# EAGLE design CPSBoard (EAGLE 6.1)
AUTHOR: Benjamin Babjak; AUTHOREMAIL: benjamin.babjak@vanderbilt.edu; PAGE1: Cover page; PAGE2: Connector; PAGE3: Analog Signals; PAGE4: Control/Digital Signals; PAGE5: Supply; REVIEWER1: Peter Volgyesi; REVIEWER2: Sandor Szilvasi; REVIEWEREMAIL1: peter.volgyesi@vanderbilt.edu; REVIEWEREMAIL2: sandor.szilvasi@vanderbilt.edu; REVISION: A; TITLE: Radio Front-End Board

## Sheet 1 of 5
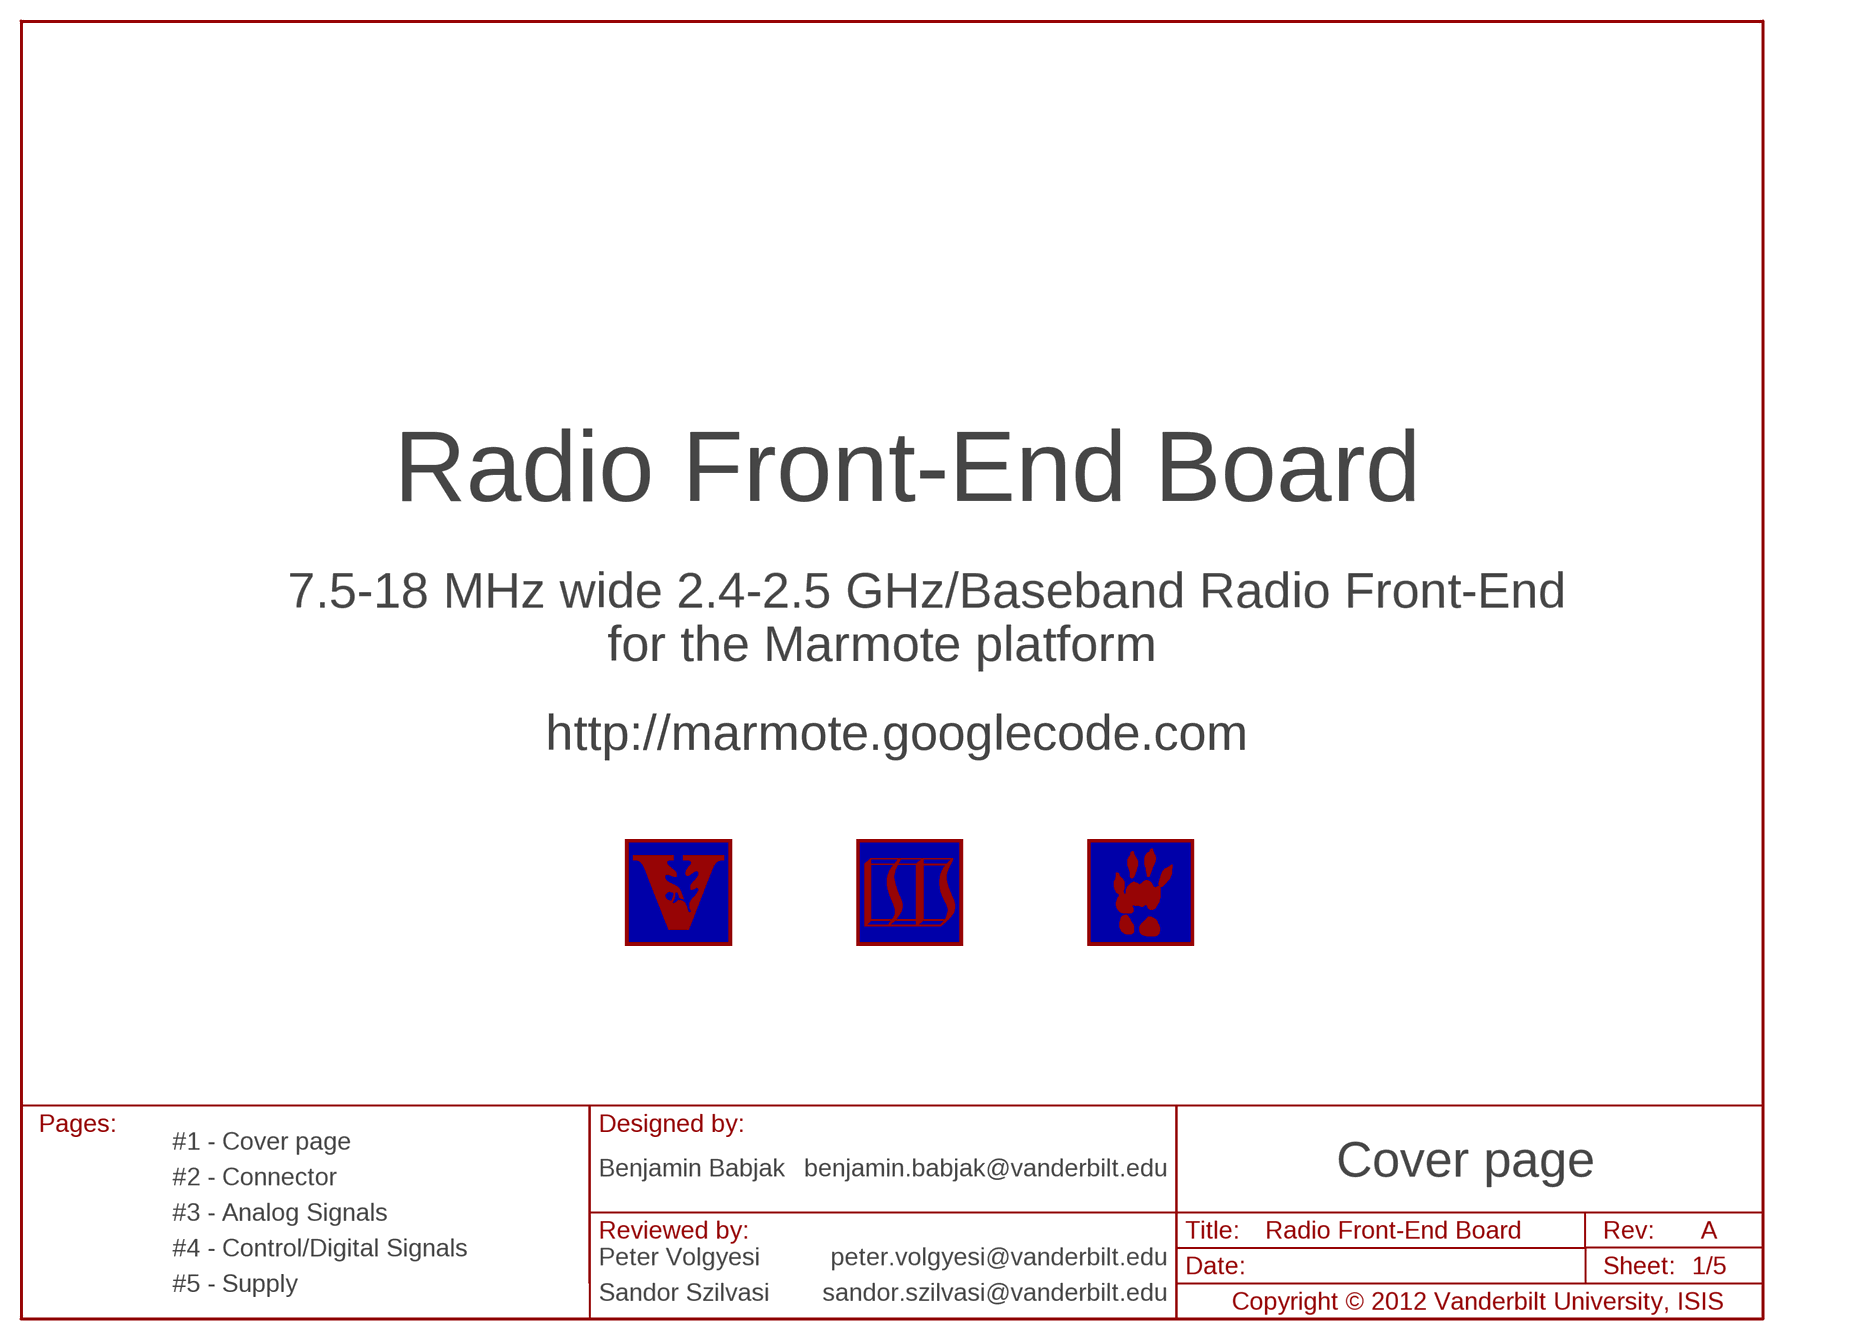
[diagram p0: schematic, sheet 1]

### Parts
LOGO1  LOGO-ISIS-600MIL-10MM-AU  [LOGO-ISIS-10MM-GOLD]
LOGO2  LOGO-MARMOTE-600MIL-10MM-AU  [LOGO-MARMOTE-10MM-GOLD]
LOGO3  LOGO-VANDERBILT-600MIL-10MM-AU  [LOGO-VANDERBILT-10MM-GOLD]

### Notes on the sheet
- 7.5-18 MHz wide 2.4-2.5 GHz/Baseband Radio Front-End
- for the Marmote platform
- http://marmote.googlecode.com

## Sheet 2 of 5
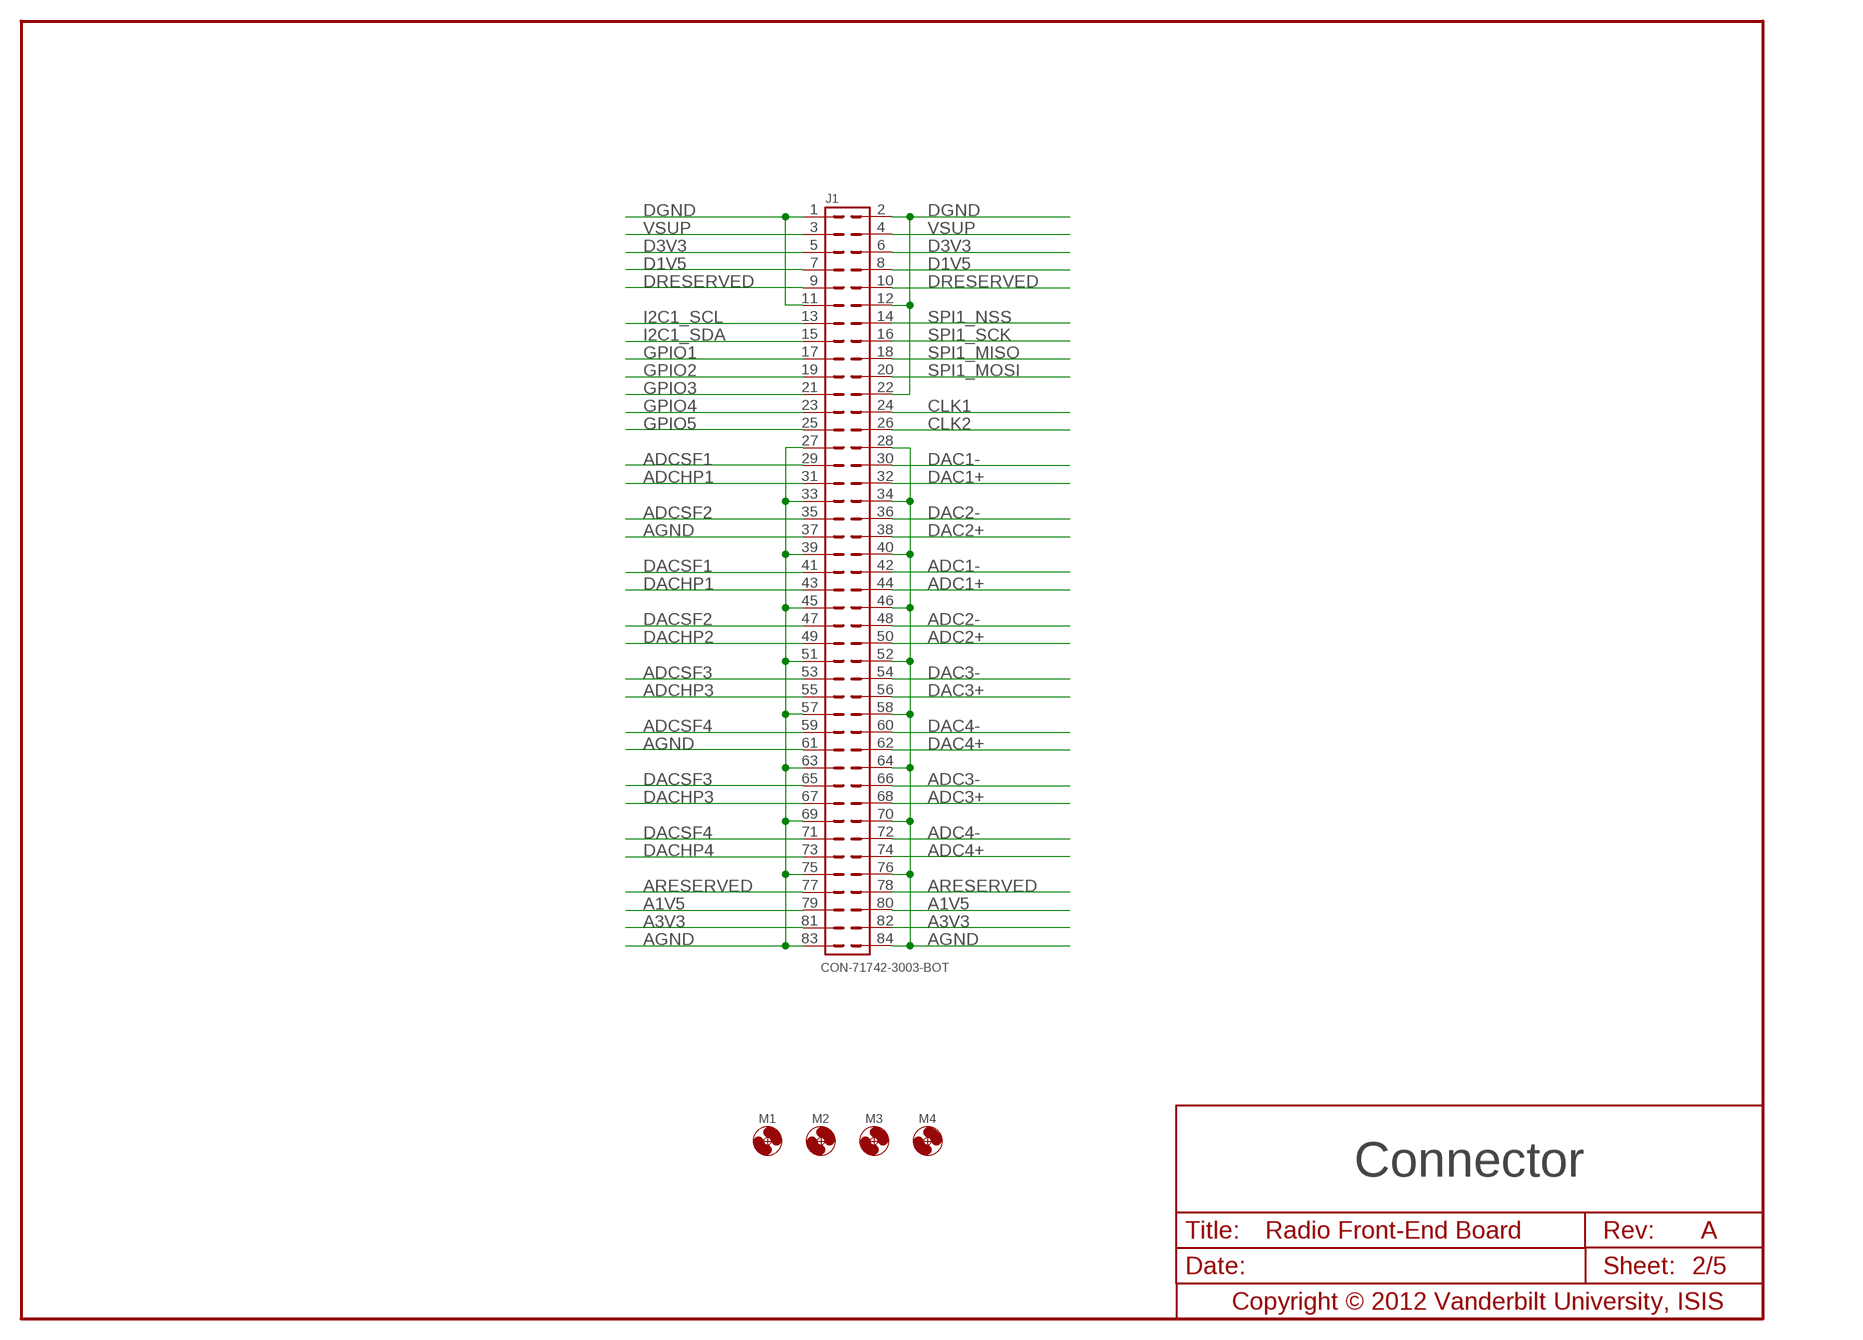
[diagram p1: schematic, sheet 2]

### Parts
J1  CON-71742-3003-BOT  [71742-3003-BOT]
M1  MOUNT-HOLE3.3  [3,3]
M2  MOUNT-HOLE3.3  [3,3]
M3  MOUNT-HOLE3.3  [3,3]
M4  MOUNT-HOLE3.3  [3,3]

### Nets
A1V5: J1.79 J1.80
A3V3: J1.81 J1.82 ; also sheet 5
ADC1+: J1.44
ADC1-: J1.42
ADC2+: J1.50
ADC2-: J1.48
ADC3+: J1.68
ADC3-: J1.66
ADC4+: J1.74
ADC4-: J1.72
ADCHP1: J1.31
ADCHP3: J1.55
ADCSF1: J1.29
ADCSF2: J1.35
ADCSF3: J1.53
ADCSF4: J1.59
AGND: J1.27 J1.28 J1.33 J1.34 J1.37 J1.39 J1.40 J1.45 J1.46 J1.51 J1.52 J1.57 J1.58 J1.61 J1.63 J1.64 J1.69 J1.70 J1.75 J1.76 J1.83 J1.84 ; also sheet 3,5
ARESERVED: J1.77 J1.78
CLK1: J1.24
CLK2: J1.26
D1V5: J1.7 J1.8
D3V3: J1.5 J1.6 ; also sheet 4
DAC1+: J1.32
DAC1-: J1.30
DAC2+: J1.38
DAC2-: J1.36
DAC3+: J1.56
DAC3-: J1.54
DAC4+: J1.62
DAC4-: J1.60
DACHP1: J1.43
DACHP2: J1.49
DACHP3: J1.67
DACHP4: J1.73
DACSF1: J1.41
DACSF2: J1.47
DACSF3: J1.65
DACSF4: J1.71
DGND: J1.1 J1.2 J1.11 J1.12 J1.22 ; also sheet 4
DRESERVED: J1.9 J1.10
GPIO1: J1.17 ; also sheet 4
GPIO2: J1.19 ; also sheet 4
GPIO3: J1.21 ; also sheet 4
GPIO4: J1.23 ; also sheet 4
GPIO5: J1.25 ; also sheet 4
I2C1_SCL: J1.13 ; also sheet 4
I2C1_SDA: J1.15 ; also sheet 4
SPI1_MISO: J1.18 ; also sheet 4
SPI1_MOSI: J1.20 ; also sheet 4
SPI1_NSS: J1.14 ; also sheet 4
SPI1_SCK: J1.16 ; also sheet 4
VSUP: J1.3 J1.4

## Sheet 3 of 5
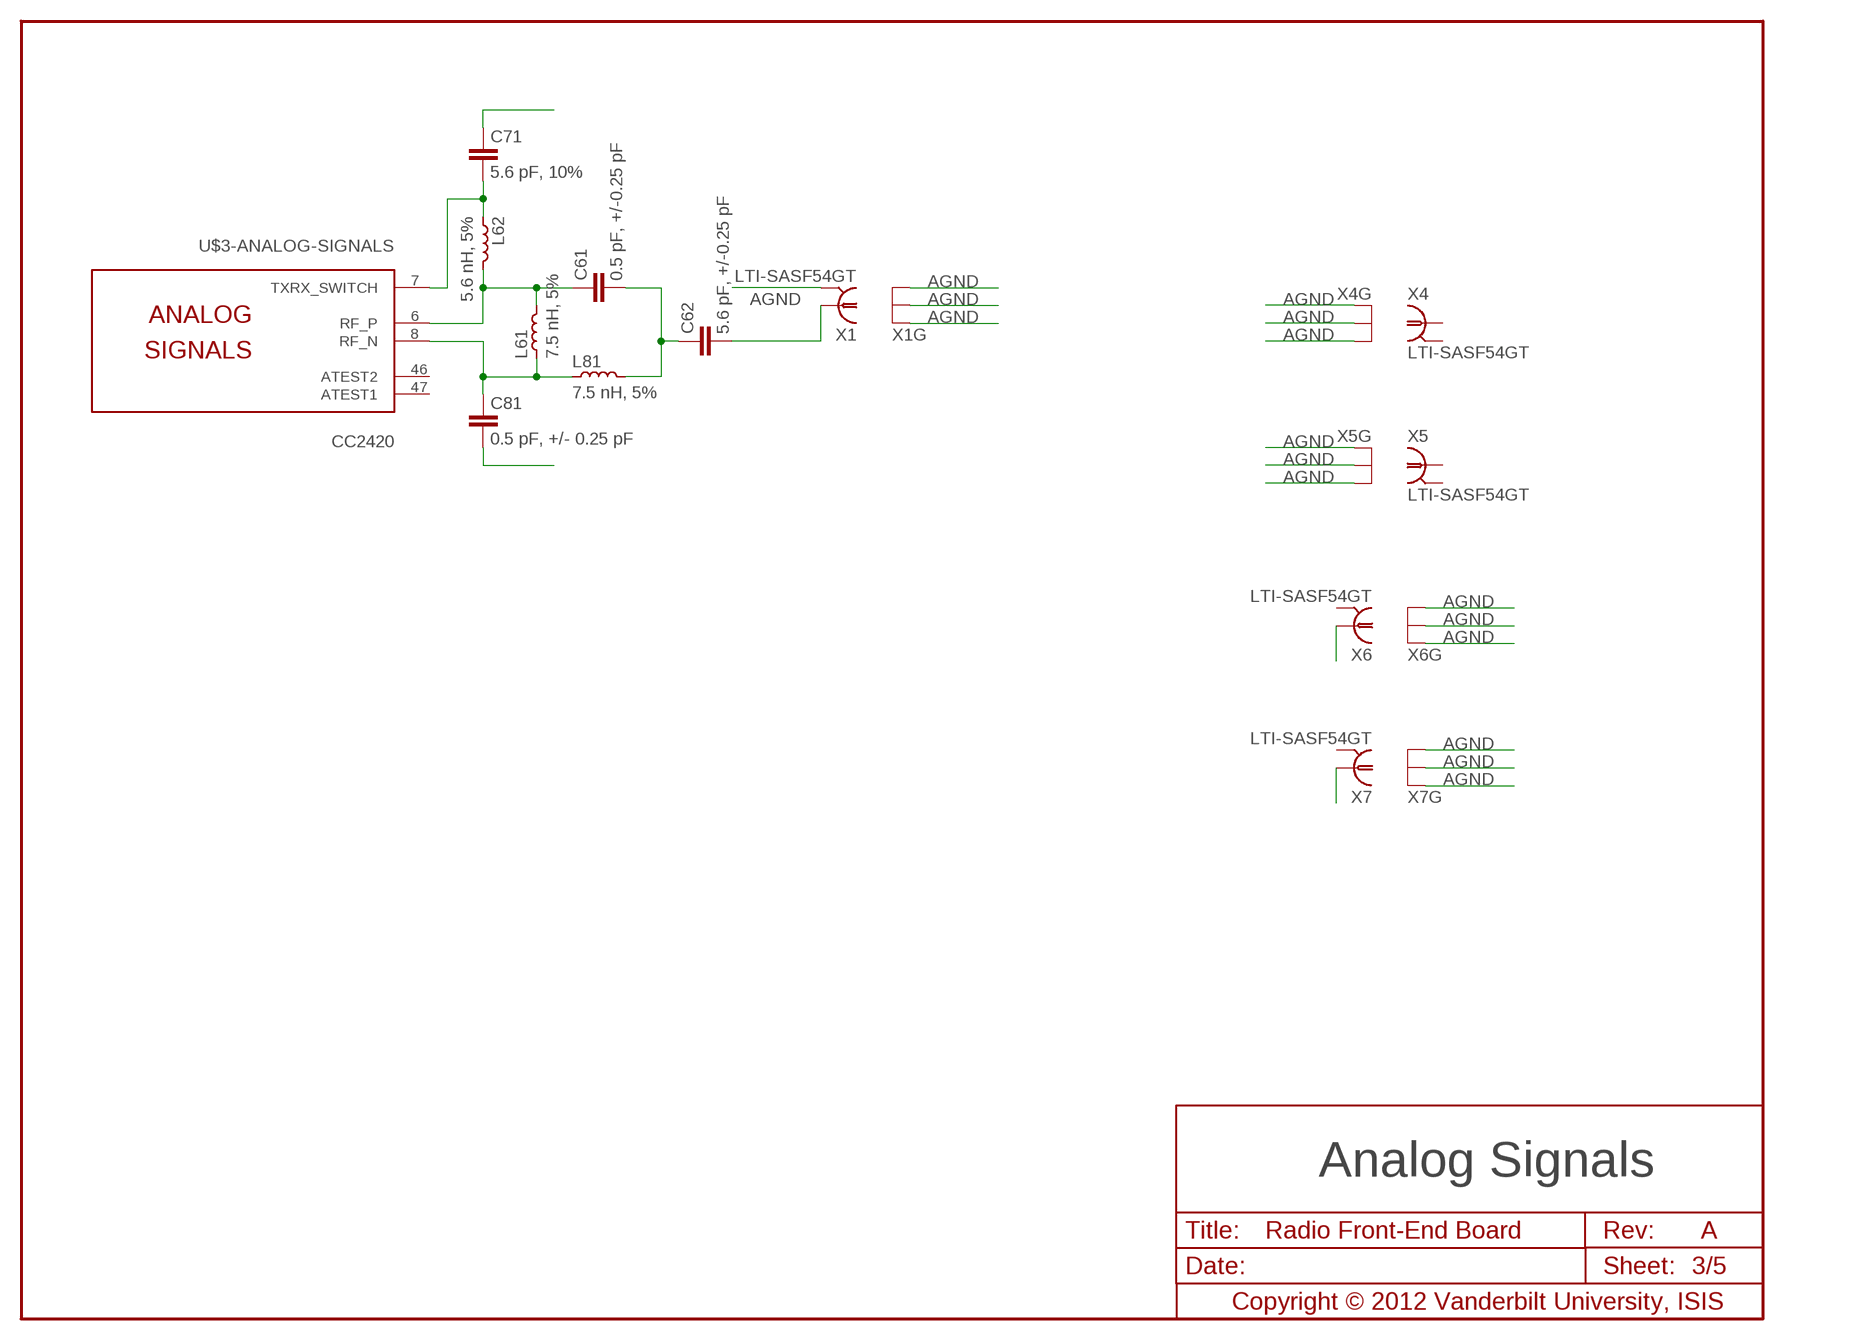
[diagram p2: schematic, sheet 3]

### Parts
C61  0.5 pF, +/-0.25 pF  C0402  [C0402]
C62  5.6 pF, +/-0.25 pF  C0402  [C0402]
C71  5.6 pF, 10%  C0402  [C0402]
C81  0.5 pF, +/- 0.25 pF  C0402  [C0402]
L61  7.5 nH, 5%  L0402  [C0402]
L62  5.6 nH, 5%  L0402  [C0402]
L81  7.5 nH, 5%  L0402  [C0402]
U$3  CC2420  [VQFN-48]
X1  LTI-SASF54GT  [LTI-SASF54GT]
X4  LTI-SASF54GT  [LTI-SASF54GT]
X5  LTI-SASF54GT  [LTI-SASF54GT]
X6  LTI-SASF54GT  [LTI-SASF54GT]
X7  LTI-SASF54GT  [LTI-SASF54GT]

### Nets
AGND: X1.2(GND) X1.3(GND) X1.4(GND) X1.5(GND) X4.3(GND) X4.4(GND) X4.5(GND) X5.3(GND) X5.4(GND) X5.5(GND) X6.3(GND) X6.4(GND) X6.5(GND) X7.3(GND) X7.4(GND) X7.5(GND) ; also sheet 2,5
N$6: C71.2 L62.1 U$3.7(-ANALOG-SIGNALS:TXRX_SWITCH)
N$7: C61.1 L61.2 L62.2 U$3.6(-ANALOG-SIGNALS:RF_P)
N$8: C62.2 X1.1
N$9: C81.1 L61.1 L81.1 U$3.8(-ANALOG-SIGNALS:RF_N)
N$11: C61.2 C62.1 L81.2
N$12: C81.2
N$13: C71.1
N$29: X6.1
N$34: X7.1
Unconnected: U$3.46(-ANALOG-SIGNALS:ATEST2) U$3.47(-ANALOG-SIGNALS:ATEST1) X4.1 X5.1

## Sheet 4 of 5
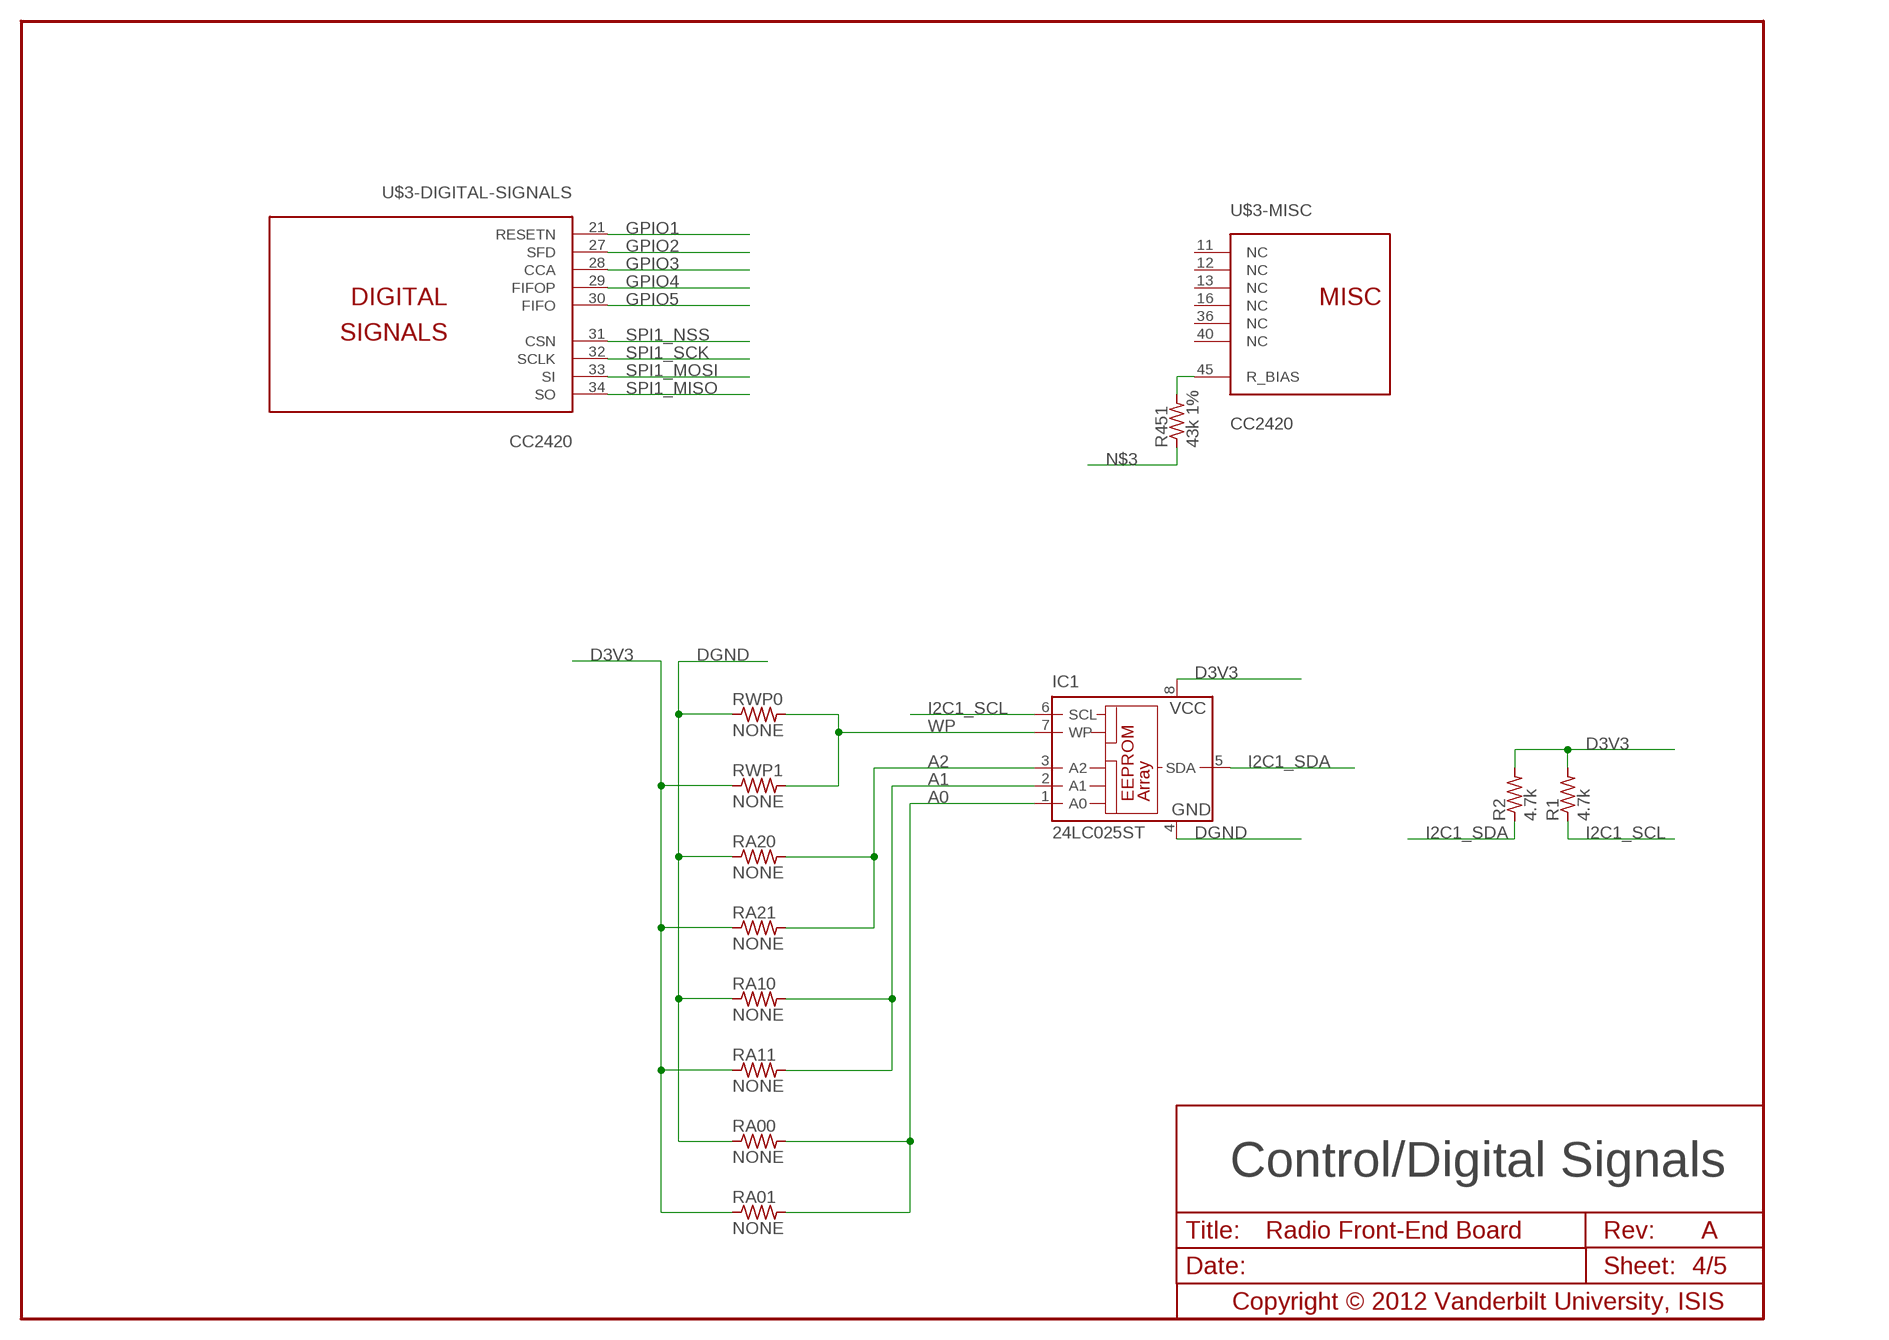
[diagram p3: schematic, sheet 4]

### Parts
IC1  24LC025ST  [TSSOP8]
R1  4.7k  R0402  [R0402]
R2  4.7k  R0402  [R0402]
R451  43k 1%  R0402  [R0402]
RA00  NONE  R0402  [R0402]
RA01  NONE  R0402  [R0402]
RA10  NONE  R0402  [R0402]
RA11  NONE  R0402  [R0402]
RA20  NONE  R0402  [R0402]
RA21  NONE  R0402  [R0402]
RWP0  NONE  R0402  [R0402]
RWP1  NONE  R0402  [R0402]

### Nets
A0: IC1.1(A0) RA00.2 RA01.2
A1: IC1.2(A1) RA10.2 RA11.2
A2: IC1.3(A2) RA20.2 RA21.2
D3V3: IC1.8(VCC) R1.2 R2.2 RA01.1 RA11.1 RA21.1 RWP1.1 ; also sheet 2
DGND: IC1.4(GND) RA00.1 RA10.1 RA20.1 RWP0.1 ; also sheet 2
GPIO1: U$3.21(-DIGITAL-SIGNALS:RESETN) ; also sheet 2
GPIO2: U$3.27(-DIGITAL-SIGNALS:SFD) ; also sheet 2
GPIO3: U$3.28(-DIGITAL-SIGNALS:CCA) ; also sheet 2
GPIO4: U$3.29(-DIGITAL-SIGNALS:FIFOP) ; also sheet 2
GPIO5: U$3.30(-DIGITAL-SIGNALS:FIFO) ; also sheet 2
I2C1_SCL: IC1.6(SCL) R1.1 ; also sheet 2
I2C1_SDA: IC1.5(SDA) R2.1 ; also sheet 2
N$2: R451.2 U$3.45(-MISC:R_BIAS)
N$3: R451.1
SPI1_MISO: U$3.34(-DIGITAL-SIGNALS:SO) ; also sheet 2
SPI1_MOSI: U$3.33(-DIGITAL-SIGNALS:SI) ; also sheet 2
SPI1_NSS: U$3.31(-DIGITAL-SIGNALS:CSN) ; also sheet 2
SPI1_SCK: U$3.32(-DIGITAL-SIGNALS:SCLK) ; also sheet 2
WP: IC1.7(WP) RWP0.2 RWP1.2
Unconnected: U$3.11(-MISC:NC) U$3.12(-MISC:NC) U$3.13(-MISC:NC) U$3.16(-MISC:NC) U$3.36(-MISC:NC) U$3.40(-MISC:NC)

## Sheet 5 of 5
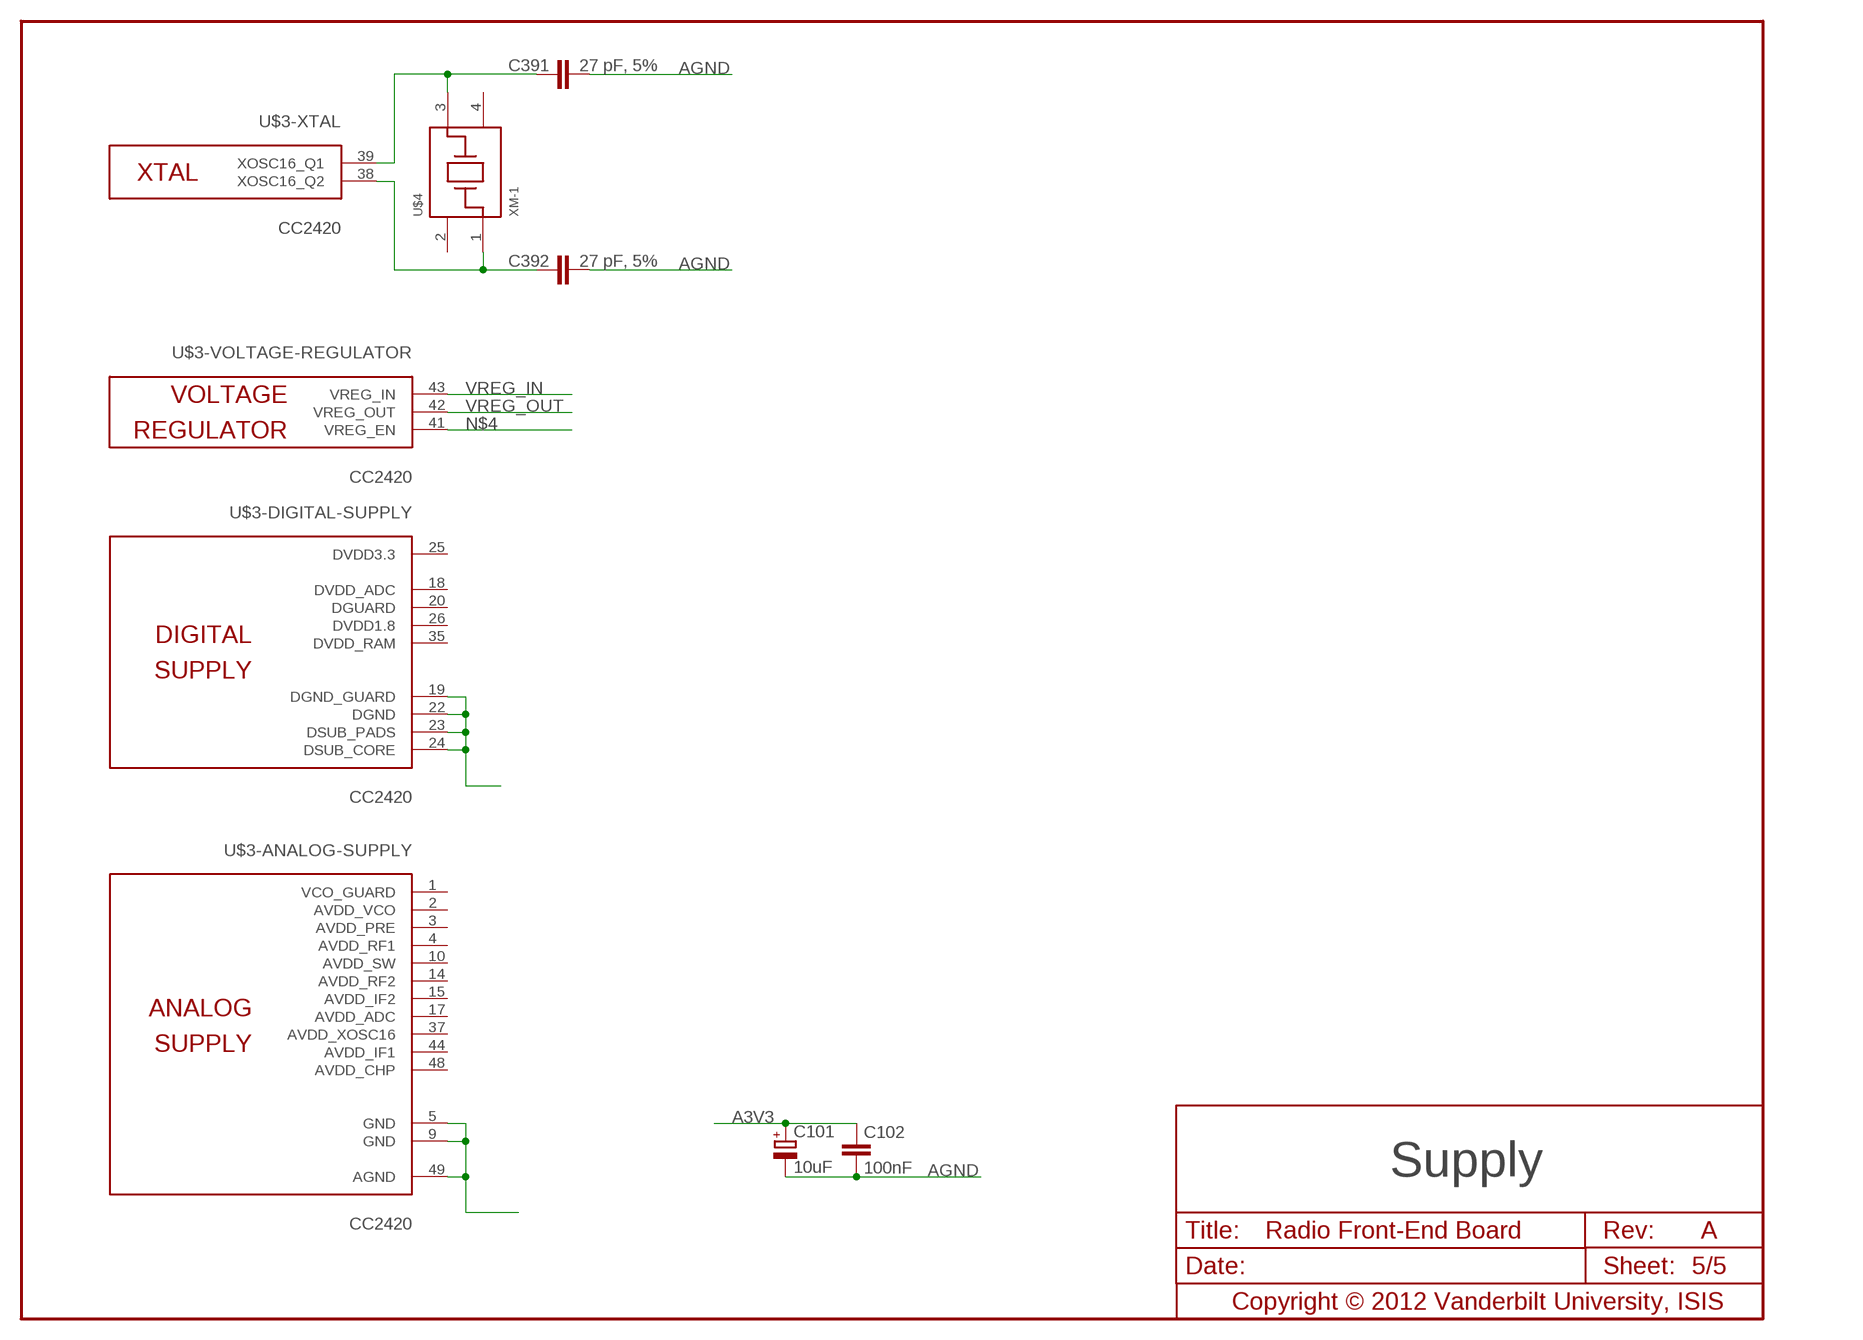
[diagram p4: schematic, sheet 5]

### Parts
C101  10uF  CPOL2012  [CPOL2012]
C102  100nF  C0402  [C0402]
C391  27 pF, 5%  C0402  [C0402]
C392  27 pF, 5%  C0402  [C0402]
U$4  XM-1  [XM-1-FOOTPRINT]

### Nets
A3V3: C101.+ C102.1 ; also sheet 2
AGND: C101.- C102.2 C391.2 C392.2 U$3.5(-ANALOG-SUPPLY:GND) U$3.9(-ANALOG-SUPPLY:GND) U$3.49(-ANALOG-SUPPLY:AGND) ; also sheet 2,3
DSUB_CORE: U$3.19(-DIGITAL-SUPPLY:DGND_GUARD) U$3.22(-DIGITAL-SUPPLY:DGND) U$3.23(-DIGITAL-SUPPLY:DSUB_PADS) U$3.24(-DIGITAL-SUPPLY:DSUB_CORE)
N$4: U$3.41(-VOLTAGE-REGULATOR:VREG_EN)
N$5: C391.1 U$3.39(-XTAL:XOSC16_Q1) U$4.3
N$10: C392.1 U$3.38(-XTAL:XOSC16_Q2) U$4.1
VREG_IN: U$3.43(-VOLTAGE-REGULATOR:VREG_IN)
VREG_OUT: U$3.42(-VOLTAGE-REGULATOR:VREG_OUT)
Unconnected: U$3.1(-ANALOG-SUPPLY:VCO_GUARD) U$3.2(-ANALOG-SUPPLY:AVDD_VCO) U$3.3(-ANALOG-SUPPLY:AVDD_PRE) U$3.4(-ANALOG-SUPPLY:AVDD_RF1) U$3.10(-ANALOG-SUPPLY:AVDD_SW) U$3.14(-ANALOG-SUPPLY:AVDD_RF2) U$3.15(-ANALOG-SUPPLY:AVDD_IF2) U$3.17(-ANALOG-SUPPLY:AVDD_ADC) U$3.18(-DIGITAL-SUPPLY:DVDD_ADC) U$3.20(-DIGITAL-SUPPLY:DGUARD) U$3.25(-DIGITAL-SUPPLY:DVDD3.3) U$3.26(-DIGITAL-SUPPLY:DVDD1.8) U$3.35(-DIGITAL-SUPPLY:DVDD_RAM) U$3.37(-ANALOG-SUPPLY:AVDD_XOSC16) U$3.44(-ANALOG-SUPPLY:AVDD_IF1) U$3.48(-ANALOG-SUPPLY:AVDD_CHP) U$4.2 U$4.4

## Power pins joined to a net without a drawn wire
GND: X4.2(GND) X5.2(GND) X6.2(GND) X7.2(GND)

## Library data of the parts
C61 C62 C71 C81 C102 C391 C392 = CPSBoard:C: CAPACITOR
C101 = CPSBoard:CPOL: POLARIZED CAPACITOR Tantalum capacitors
IC1 = CPSBoard:24*: Serial EEPROM I2C; MF: MICROCHIP; MPN: 24LC025-I/ST; OC_FARNELL: unknown; OC_NEWARK: 92C7100
J1 = CPSBoard:CON-71742: Board-to-Board Connector 1.00mm (.039") Mezzanine IEEE 1386 Receptacle - Dual Row 64-pin, SMT, Vertical Stacking Source: http://www.molex.com/molex/products/datasheet.jsp?part=active/0714392164_PCB_RECEPTACLES.xml&channel=Products
L61 L62 L81 = CPSBoard:L: INDUCTOR
LOGO1 = Logo:LOGO-ISIS-600MIL: ISIS Logo Official logo of the Institute for Software Integrated Systems (ISIS), Vanderbilt as of 2011 Generated from 360 x 360 px bitmap and scaled to 600 x 600 mil v1.0 Initial design
LOGO2 = Logo:LOGO-MARMOTE-600MIL: Marmote Platform Logo Preliminary logo for the Marmote Platform (http://marmote.googlecode.com) Generated from 360 x 360 px bitmap and scaled to 600 x 600 mil v1.1 Source bitmap smoothened v1.0 Initial design
LOGO3 = Logo:LOGO-VANDERBILT-600MIL: Vanderbilt Logo Official Framed Vanderbilt Logo Generated from 360 x 360 px bitmap and scaled to 600 x 600 mil v1.1 Source bitmap smoothened v1.0 Initial design
M1-M4 = CPSBoard:MOUNT-HOLE: MOUNTING HOLE with drill center marker
R1 R2 R451 RA00 RA01 RA10 RA11 RA20 RA21 RWP0 RWP1 = CPSBoard:R: RESISTOR
U$3 = CPSBoard:CC2420
U$4 = CPSBoard:XM-1
X1 X4-X7 = CPSBoard:LTI-SASF54GT: SMA vertical PCB thrue hole jack Source: Lighthorse Technologies, inc. SASF54GT.pdf; OC_FARNELL: unknown; OC_NEWARK: unknown

## Board
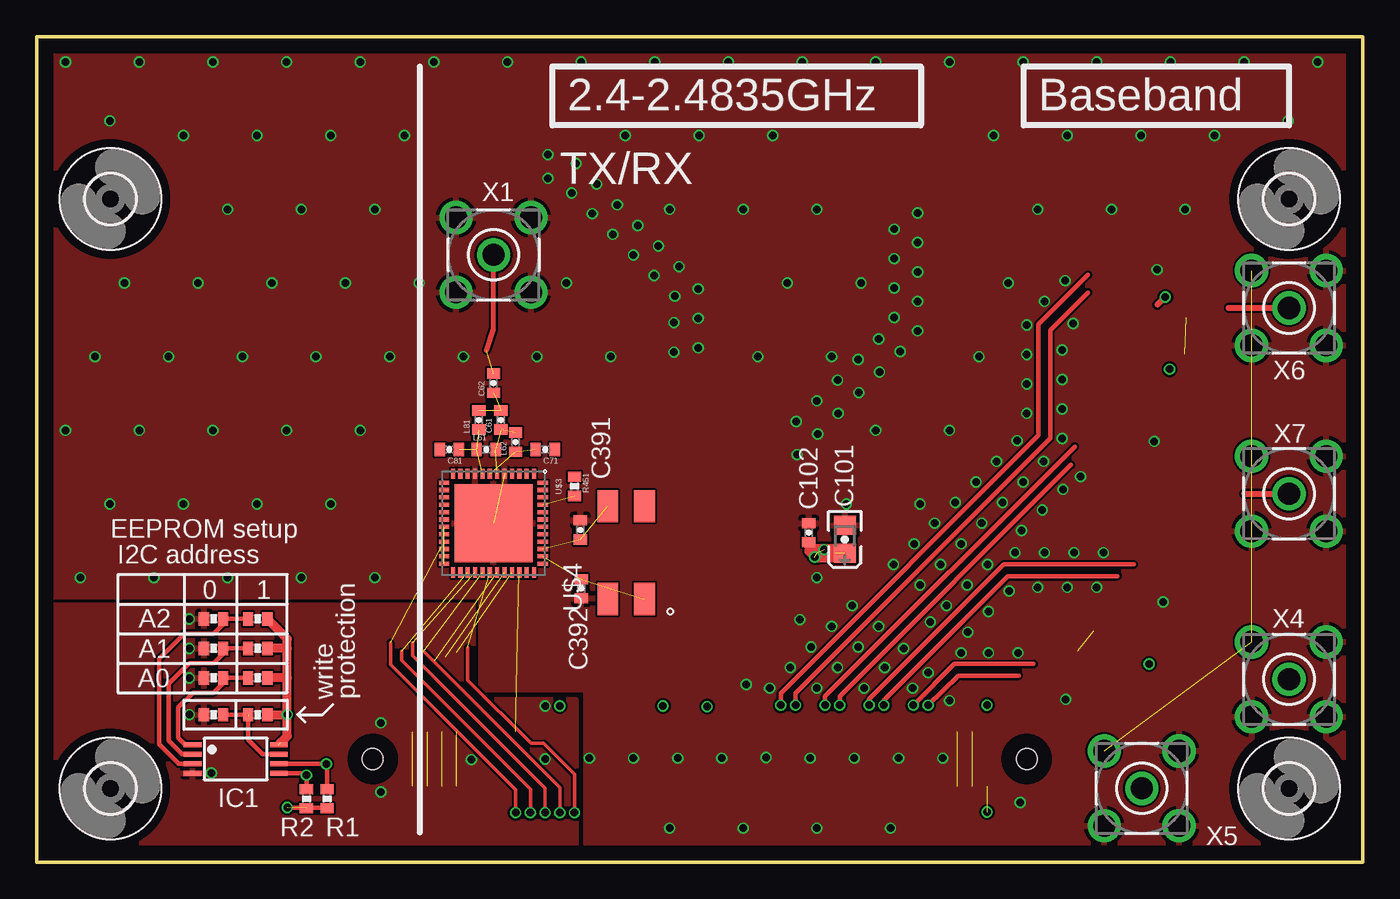
[diagram p5: board, top side]
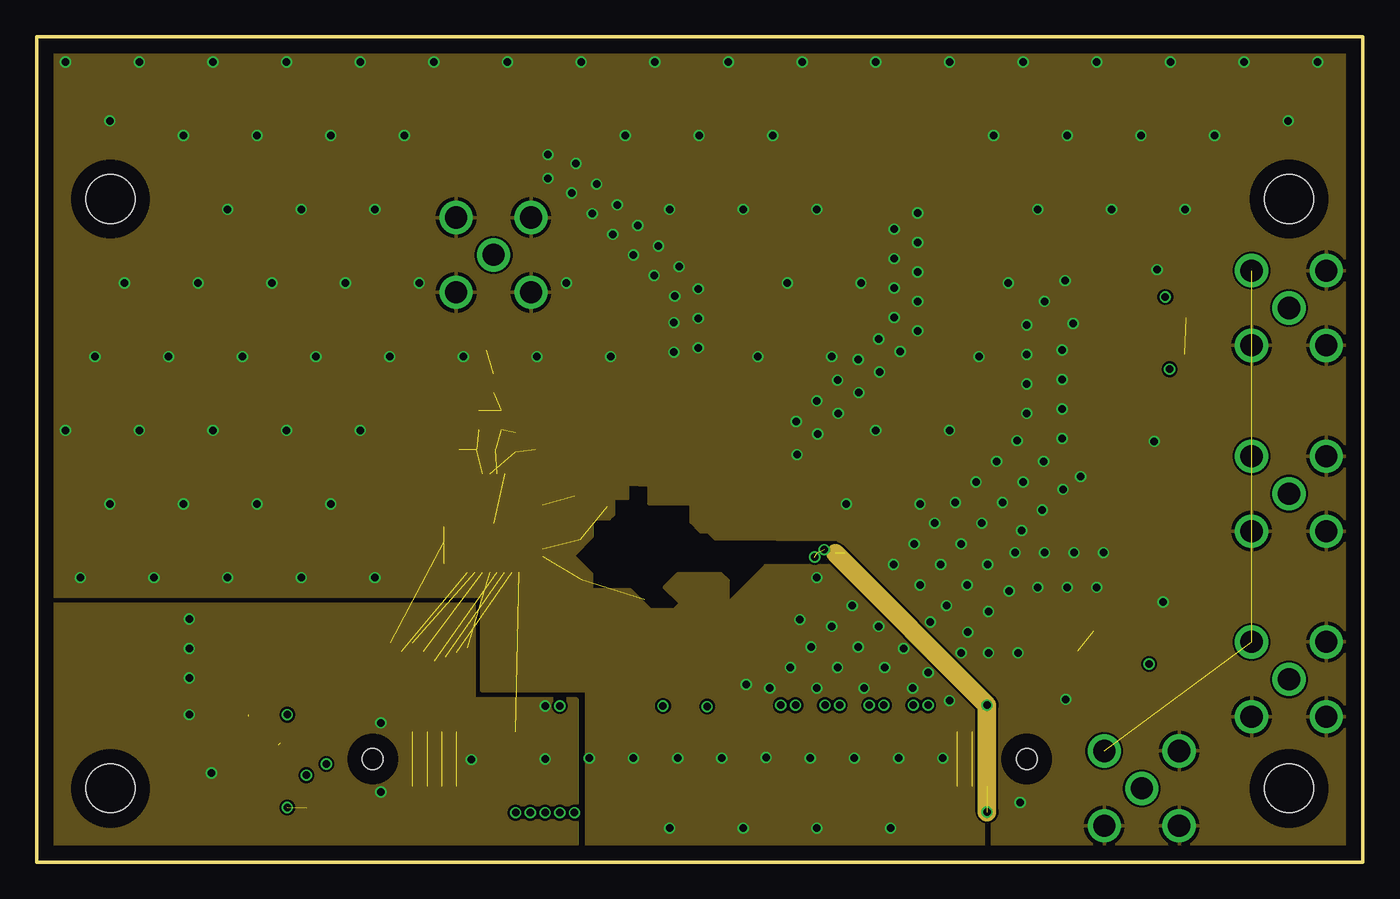
[diagram p6: board, inner layer Route2]
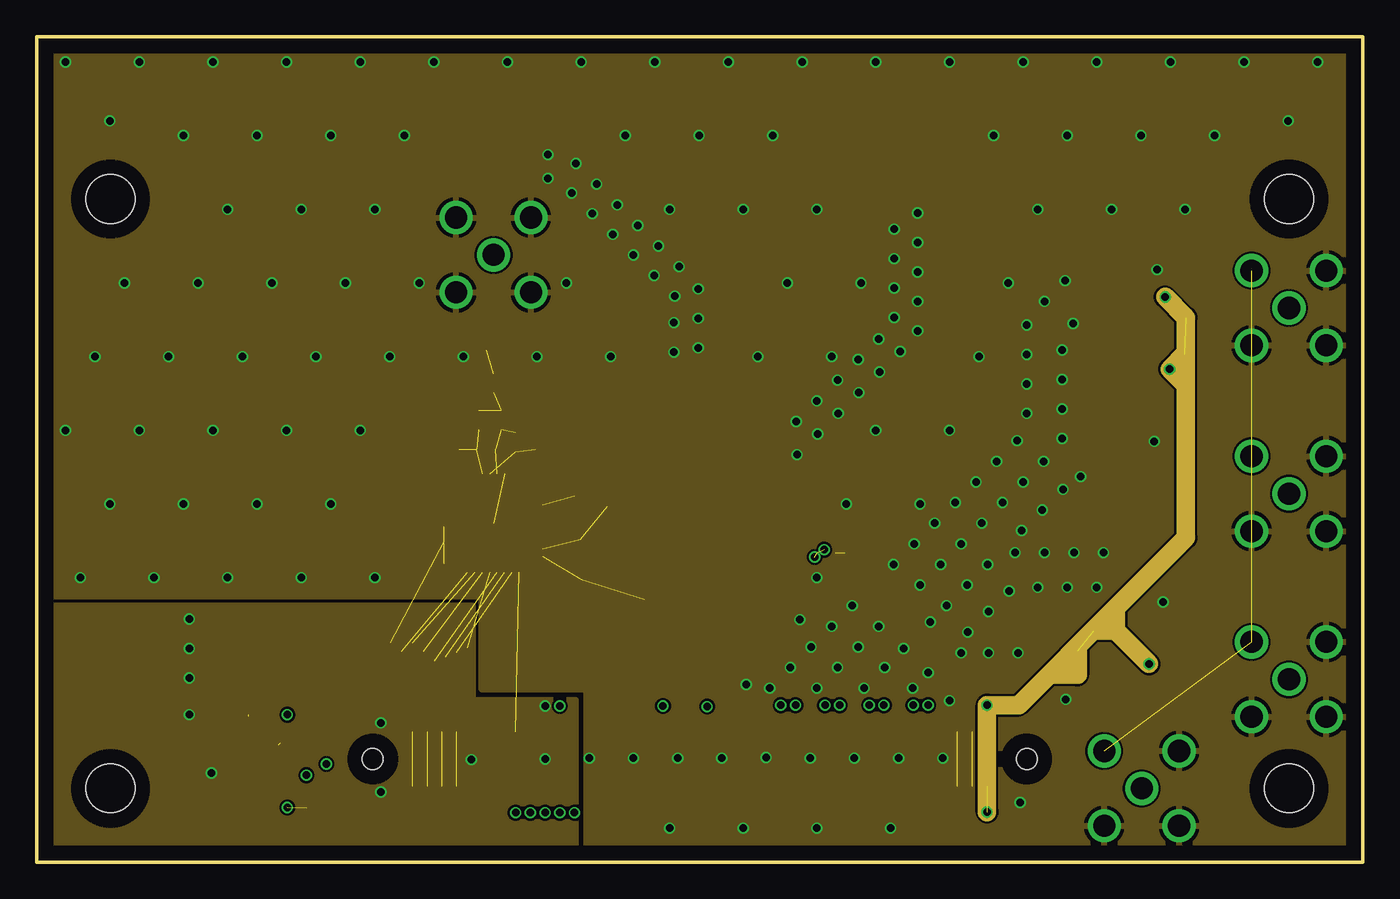
[diagram p7: board, inner layer Route3]
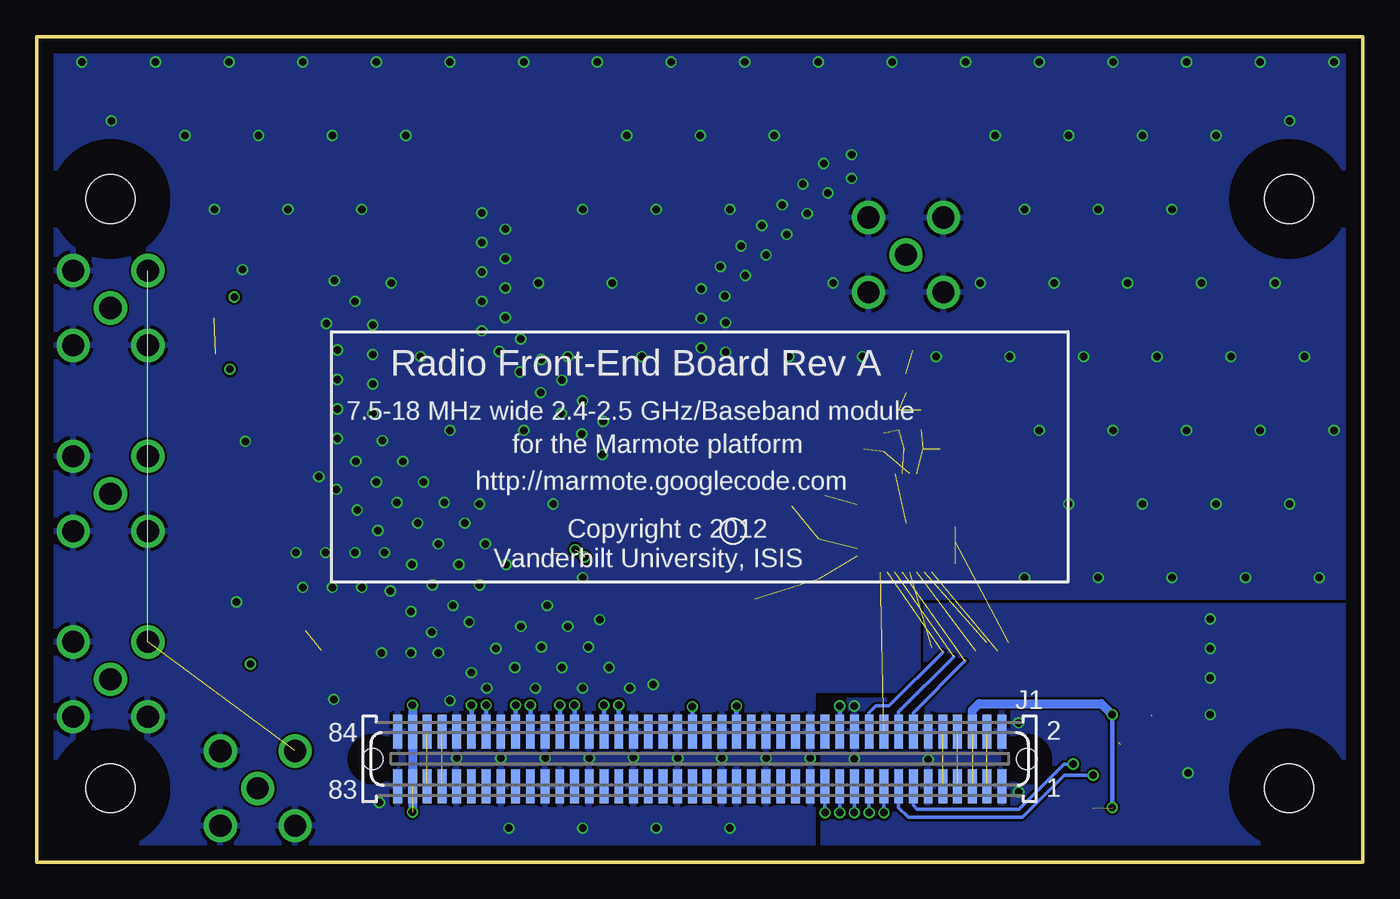
[diagram p8: board, bottom side, seen from below]

Size 90 x 56 mm. Coordinates in mm from the lower left corner, seen from the top.
Outline: 0,0 0,56 90,56 90,0 0,0
Copper layers (1*2+3*16): Top 0.0356mm / dielectric 8mil / Route2 0.0356mm / dielectric 39mil / Route3 0.0356mm / dielectric 8mil / Bottom 0.0356mm
Design rules: minimum track width 6mil, minimum drill 12mil, track to track 6mil, track to pad 6mil, pad to pad 6mil, via to via 6mil, smd to smd 6mil, copper to edge 40mil, drill to drill 8mil, minimum pad ring 10mil, minimum via ring 4mil, stop-mask expansion 2mil, vias tented up to drill 25mil, thermal gap 10mil

### Footprints (pad centres in the part's own frame; a part is rotated, then mirrored left to right if it is on the bottom)
C0402 = smd 0.7 x 0.9: 1 -0.65,0; 2 0.65,0
CPOL2012 = smd 1.3 x 1.5: + -0.95,0; - 0.95,0
TSSOP8 = smd 0.35 x 1.2: 1 -0.975,-2.925; 2 -0.325,-2.925; 3 0.325,-2.925; 4 0.975,-2.925; 5 0.975,2.925; 6 0.325,2.925; 7 -0.325,2.925; 8 -0.975,2.925
71742-3003-BOT = smd 0.6 x 2.3: 1 -20.5,1.85; 2 -20.5,-1.85; 3 -19.5,1.85; 4 -19.5,-1.85; 5 -18.5,1.85; 6 -18.5,-1.85; 7 -17.5,1.85; 8 -17.5,-1.85; 9 -16.5,1.85; 10 -16.5,-1.85; 11 -15.5,1.85; 12 -15.5,-1.85; 13 -14.5,1.85; 14 -14.5,-1.85; 15 -13.5,1.85; 16 -13.5,-1.85; 17 -12.5,1.85; 18 -12.5,-1.85; 19 -11.5,1.85; 20 -11.5,-1.85; 21 -10.5,1.85; 22 -10.5,-1.85; 23 -9.5,1.85; 24 -9.5,-1.85; 25 -8.5,1.85; 26 -8.5,-1.85; 27 -7.5,1.85; 28 -7.5,-1.85; 29 -6.5,1.85; 30 -6.5,-1.85; 31 -5.5,1.85; 32 -5.5,-1.85; 33 -4.5,1.85; 34 -4.5,-1.85; 35 -3.5,1.85; 36 -3.5,-1.85; 37 -2.5,1.85; 38 -2.5,-1.85; 39 -1.5,1.85; 40 -1.5,-1.85; 41 -0.5,1.85; 42 -0.5,-1.85; 43 0.5,1.85; 44 0.5,-1.85; 45 1.5,1.85; 46 1.5,-1.85; 47 2.5,1.85; 48 2.5,-1.85; 49 3.5,1.85; 50 3.5,-1.85; 51 4.5,1.85; 52 4.5,-1.85; 53 5.5,1.85; 54 5.5,-1.85; 55 6.5,1.85; 56 6.5,-1.85; 57 7.5,1.85; 58 7.5,-1.85; 59 8.5,1.85; 60 8.5,-1.85; 61 9.5,1.85; 62 9.5,-1.85; 63 10.5,1.85; 64 10.5,-1.85; 65 11.5,1.85; 66 11.5,-1.85; 67 12.5,1.85; 68 12.5,-1.85; 69 13.5,1.85; 70 13.5,-1.85; 71 14.5,1.85; 72 14.5,-1.85; 73 15.5,1.85; 74 15.5,-1.85; 75 16.5,1.85; 76 16.5,-1.85; 77 17.5,1.85; 78 17.5,-1.85; 79 18.5,1.85; 80 18.5,-1.85; 81 19.5,1.85; 82 19.5,-1.85; 83 20.5,1.85; 84 20.5,-1.85 | hole 1.4: -22.2,0; 22.2,0
3,3 = hole 3.3: 0,0
R0402 = smd 0.7 x 0.9: 1 -0.65,0; 2 0.65,0
VQFN-48 = smd 0.69 x 0.28: 1 -3.345,2.75; 2 -3.345,2.25; 3 -3.345,1.75; 4 -3.345,1.25; 5 -3.345,0.75; 6 -3.345,0.25; 7 -3.345,-0.25; 8 -3.345,-0.75; 9 -3.345,-1.25; 10 -3.345,-1.75; 11 -3.345,-2.25; 12 -3.345,-2.75; 25 3.345,-2.75; 26 3.345,-2.25; 27 3.345,-1.75; 28 3.345,-1.25; 29 3.345,-0.75; 30 3.345,-0.25; 31 3.345,0.25; 32 3.345,0.75; 33 3.345,1.25; 34 3.345,1.75; 35 3.345,2.25; 36 3.345,2.75 | smd 0.28 x 0.69: 13 -2.75,-3.345; 14 -2.25,-3.345; 15 -1.75,-3.345; 16 -1.25,-3.345; 17 -0.75,-3.345; 18 -0.25,-3.345; 19 0.25,-3.345; 20 0.75,-3.345; 21 1.25,-3.345; 22 1.75,-3.345; 23 2.25,-3.345; 24 2.75,-3.345; 37 2.75,3.345; 38 2.25,3.345; 39 1.75,3.345; 40 1.25,3.345; 41 0.75,3.345; 42 0.25,3.345; 43 -0.25,3.345; 44 -0.75,3.345; 45 -1.25,3.345; 46 -1.75,3.345; 47 -2.25,3.345; 48 -2.75,3.345 | smd 5.3 x 5.3: 49 0,0
XM-1-FOOTPRINT = smd 2.2 x 1.4: 1 -3.15,-1.25; 2 -3.15,1.25; 3 3.15,1.25; 4 3.15,-1.25
LTI-SASF54GT = drill 1.5 pad 2.2: 1 0,0; 2 -2.54,2.54; 3 2.54,2.54; 4 2.54,-2.54; 5 -2.54,-2.54

### Placement (x,y rotation side)
C61  31.5,30 90 top
C62  31,32.5 90 top
C71  34.5,28 180 top
C81  28,28 180 top
C101  54.85,21.9 90 top
C102  52.4,22.35 90 top
C391  36.9,22.55 90 top
C392  36.95,18.55 270 top
IC1  13.5,7 270 top
J1  45,7 180 bottom
L61  30.5,28 0 top
L62  32.5,28.5 90 top
L81  30,30 90 top
LOGO1  14,28 0 top
LOGO2  14,40 0 top
LOGO3  2,28 0 top
M1  5,45 0 top
M2  85,45 0 top
M3  5,5 0 top
M4  85,5 0 top
R1  19.7,4.3 270 top
R2  18.3,4.3 270 top
R451  36.5,25.5 270 top
RA00  12,12.5 0 top
RA01  15,12.5 180 top
RA10  12,14.5 0 top
RA11  15,14.5 180 top
RA20  12,16.5 0 top
RA21  15,16.5 180 top
RWP0  12,10 0 top
RWP1  15,10 180 top
U$3  31,23 270 top
U$4  40,21 90 top
X1  31,41.2 0 top
X4  85,12.4 0 top
X5  75,5 0 top
X6  85,37.6 0 top
X7  85,25 0 top

### Tracks (layer width: path | path; a pad name or v marks a point on that pad's centre or on a via)
A0
  Top 0.305: RA01.2 RA00.2 12.65,12.15 12,11.5 10.6,11.5 9.6,10.5 9.6,8.45 10.05,8 10.15,8 10.18,7.97 IC1.1
A1
  Top 0.305: RA11.2 RA10.2 12.65,14.15 12,13.5 10.35,13.5 8.95,12.1 8.95,8.25 9.88,7.33 IC1.2
A1V5  (1 unrouted)
A2
  Top 0.305: RA21.2 RA20.2 12.65,16.15 12,15.5 10,15.5 8.3,13.8 8.3,8 9.62,6.67 IC1.3
A3V3  (via drill 0.51)  (6 unrouted)
  Top 0.406: 76.08,37.83 v76.6,38.35 | v75.5,13.45
  Top 0.61: C102.1 52.4,21.1 v52.8,20.7
  Top 1.27: C101.+ 52.95,20.95
  Route2 1.27: v64.5,3.4 v64.5,10.65 54.2,20.95
  Route3 1.27: 73.25,17.25 66.65,10.65 v64.5,10.65 v64.5,3.4 | 73.25,17.25 78,22 78,36.95 v76.6,38.35 | 77.9,34.45 v76.9,33.45 77.85,32.5 | 73.25,17.25 73.25,15.7 | 70.65,14.35 70.65,12.7 68.85,12.7 | 73.25,15.7 71.75,15.7 | v75.5,13.45 73.25,15.7
  Bottom 0.61: J1.82 v64.5,3.4 | v64.5,10.65 64.5,9.85
  other vias: 53.45,21.2
ADC1+  (via drill 0.51)
  Bottom 0.305: J1.44 v45.5,10.55
ADC3+  (via drill 0.51)
  Top 0.305: v57.5,10.65 57.5,11 65.9,19.4 73.35,19.4
  Bottom 0.305: J1.68 v57.5,10.65
ADC3-  (via drill 0.51)
  Top 0.305: v56.5,10.65 56.5,11.05 65.65,20.2 74.45,20.2
  Bottom 0.305: J1.66 v56.5,10.65
ADC4+  (via drill 0.51)
  Top 0.305: v60.5,10.65 62.55,12.65 66.65,12.65
  Bottom 0.305: J1.74 v60.5,10.65
ADC4-  (via drill 0.51)
  Top 0.305: v59.5,10.65 62.3,13.45 67.65,13.45
  Bottom 0.305: J1.72 v59.5,10.65
AGND  (via drill 0.51)  (1 unrouted)
  other vias: 66.75,4.05 61.5,7.05 58.5,7.05 55.5,7.05 52.5,7.05 49.5,7.1 46.5,7.05 43.5,7.05 40.5,7.05 37.5,7.05 48.15,12.05 44.9,34.9 44.9,36.9 44.9,38.9 43.25,34.6 43.25,36.6 43.6,40.4 43.3,38.4 41.9,39.8 40.5,41.2 39.1,42.6 37.7,44 36.3,45.4 34.7,46.4 42.2,41.8 40.8,43.2 39.4,44.6 38,46 36.6,47.4 34.7,48 51.55,29.9 52.95,31.3 54.35,32.7 55.75,34.1 57.15,35.5 58.2,36.95 58.2,38.95 58.2,40.95 58.2,42.95 51.6,27.65 53,29.05 54.4,30.45 55.8,31.85 57.2,33.25 58.6,34.65 59.8,36.05 59.8,38.05 59.8,40.05 59.8,42.05 59.8,44.05 76.05,40.2 75.85,28.55 76.45,17.65 69.85,11.05 61.95,10.95 60.5,12.85 59.45,11.8 62.75,14.2 64.6,14.2 66.6,14.2 56.15,11.8 57.55,13.2 58.85,14.5 61.75,17.4 63.15,18.8 64.55,20.2 66.4,21 68.4,21 70.4,21 72.4,21 63.2,15.6 64.6,17 66,18.4 67.95,18.65 69.95,18.65 71.95,18.65 66.85,22.5 68.25,23.9 69.65,25.3 70.85,26.15 52.95,11.8 54.35,13.2 55.75,14.6 57.15,16 59.95,18.8 61.35,20.2 62.75,21.6 64.15,23 65.55,24.4 66.95,25.8 68.35,27.2 49.75,11.8 51.15,13.2 52.55,14.6 53.95,16 55.35,17.4 58.15,20.2 59.55,21.6 60.95,23 62.35,24.4 63.75,25.8 65.15,27.2 66.55,28.6 67.2,30.45 69.6,28.75 69.6,30.75 69.6,32.75 69.6,34.75 70.35,36.55 67.2,32.45 67.2,34.45 67.2,36.45 68.4,38.05 69.8,39.45 1.95,54.3 6.95,54.3 11.95,54.3 16.95,54.3 21.95,54.3 26.95,54.3 31.95,54.3 36.95,54.3 41.95,54.3 46.95,54.3 51.95,54.3 56.95,54.3 61.95,54.3 66.95,54.3 71.95,54.3 76.95,54.3 81.95,54.3 86.95,54.3 4.95,50.3 9.95,49.3 14.95,49.3 19.95,49.3 24.95,49.3 39.95,49.3 44.95,49.3 49.95,49.3 64.95,49.3 69.95,49.3 74.95,49.3 79.95,49.3 84.95,50.3 12.95,44.3 17.95,44.3 22.95,44.3 42.95,44.3 47.95,44.3 52.95,44.3 67.95,44.3 72.95,44.3 77.95,44.3 5.95,39.3 10.95,39.3 15.95,39.3 20.95,39.3 25.95,39.3 35.95,39.3 50.95,39.3 55.95,39.3 65.95,39.3 3.95,34.3 8.95,34.3 13.95,34.3 18.95,34.3 23.95,34.3 28.95,34.3 33.95,34.3 38.95,34.3 48.95,34.3 53.95,34.3 63.95,34.3 1.95,29.3 6.95,29.3 11.95,29.3 16.95,29.3 21.95,29.3 61.95,29.3 4.95,24.3 9.95,24.3 14.95,24.3 19.95,24.3 56.95,29.3 59.95,24.3 2.95,19.3 7.95,19.3 12.95,19.3 17.95,19.3 22.95,19.3 52.95,19.3 60.65,16.3 54.95,24.3 51.8,16.45 42.95,2.3 47.95,2.3 52.95,2.3 57.95,2.3
  pour Top: 0,56 90,56 90,0 37.3,0 37.3,11.7 30.2,11.7 30.2,18 0,18
  pour Route3: 0,56 90,56 90,0 37.3,0 37.3,11.7 30.2,11.7 30.2,18 0,18
  pour Route2: 0,56 90,56 90,0 64.85,0 64.85,11.35 54.35,21.85 46.05,21.9 45.55,22.4 45.05,22.4 44.4,23.05 44.4,24.3 41.55,24.3 41.55,25.55 40.1,25.6 40.1,24.65 39.15,24.65 39.15,23.55 38.85,23.25 37.7,23.25 37.7,22.05 36.45,20.8 37.65,19.6 37.65,18.5 40.3,18.5 41.65,17.15 43.25,17.15 43.65,17.55 42.55,18.65 43.5,19.6 46.45,19.6 46.9,19.15 46.9,17.6 49.45,20.15 54.05,20.15 64.25,9.95 64.25,0 37.3,0 37.3,11.6 30.2,11.6 30.2,18 0,18
  pour Bottom: 0,56 90,56 90,0 37.3,0 37.3,11.7 30.2,11.7 30.2,18 0,18
ARESERVED  (1 unrouted)
CLK1  (via drill 0.51)
  Bottom 0.305: J1.24 v35.5,10.6
D1V5  (1 unrouted)
D3V3  (via drill 0.51)  (3 unrouted)
  Top 0.305: v17,3.7 19.65,3.7 R1.2
  Top 0.61: RWP1.1 v17,10 | RA21.1 17,15.15 17,14.5 | v17,10 17,8.55 16.55,8.1 | 17,12.5 17,14.5 | v17,10 17,12.5 | 17,14.5 RA11.1 | 17,12.5 RA01.1
  Bottom 0.305: v17,3.7 v17,10
  Bottom 0.61: J1.6 26.5,10.3 26.05,10.75 17.75,10.75 v17,10
DAC2+  (via drill 0.51)
  Route3 0.203: v42.5,10.6 42.5,10.85
  Bottom 0.305: J1.38 v42.5,10.6
DAC3+  (via drill 0.51)
  Top 0.305: v51.5,10.65 51.5,11.45 68.8,28.75 68.8,36.1 71.35,38.65
  Bottom 0.305: J1.56 v51.5,10.65
DAC3-  (via drill 0.51)
  Top 0.305: v50.5,10.65 50.5,11.45 68,28.95 68,36.5 71.35,39.85
  Bottom 0.305: J1.54 v50.5,10.65
DAC4+  (via drill 0.51)
  Top 0.305: v54.5,10.65 54.5,11.25 70.2,26.95
  Bottom 0.305: J1.62 v54.5,10.65
DAC4-  (via drill 0.51)
  Top 0.305: v53.5,10.65 53.5,11.25 70.45,28.2
  Bottom 0.305: J1.60 v53.5,10.65
DGND  (via drill 0.51)
  other vias: 29.5,6.95 34.5,7 10.35,10 10.35,14.5 10.35,16.5 10.35,12.5 11.85,6.05 34.5,10.6 23.35,9.45 23.35,4.75
  pour Top: 0,0 36.6,0 36.6,11 29.6,11 29.6,17.4 0,17.4
  pour Route2: 0,0 36.6,0 36.6,11 29.6,11 29.6,17.4 0,17.4
  pour Route3: 0,0 36.6,0 36.6,11 29.6,11 29.6,17.4 0,17.4
  pour Bottom: 0,0 36.6,0 36.6,11 29.6,11 29.6,17.4 0,17.4
DRESERVED  (1 unrouted)
DSUB_CORE  (3 unrouted)
GND  (3 unrouted)
GPIO1  (via drill 0.51)  (1 unrouted)
  Top 0.254: 24,14.9 24,13.4 32.5,4.9 v32.5,3.35
  Bottom 0.254: J1.17 v32.5,3.35
GPIO2  (via drill 0.51)  (1 unrouted)
  Top 0.254: 24.75,14.3 24.75,13.7 33.5,4.95 v33.5,3.35
  Bottom 0.254: J1.19 v33.5,3.35
GPIO3  (via drill 0.51)  (1 unrouted)
  Top 0.254: 25.5,14.9 25.5,14 34.5,5 v34.5,3.35
  Bottom 0.254: J1.21 v34.5,3.35
GPIO4  (via drill 0.51)  (1 unrouted)
  Top 0.254: 26.25,14.3 35.5,5.05 v35.5,3.35
  Bottom 0.254: J1.23 v35.5,3.35
GPIO5  (via drill 0.51)  (1 unrouted)
  Top 0.254: 29.25,14.55 29.25,12.35 33.55,8.05 34.4,8.05 36.5,5.95 v36.5,3.35
  Bottom 0.254: J1.25 v36.5,3.35
I2C1_SCL  (via drill 0.51)
  Top 0.254: 19.62,6.67 v19.65,6.65
  Top 0.305: IC1.6 19.62,6.67 | R1.1 19.7,6.6 v19.65,6.65
  Bottom 0.254: J1.13 30.5,3.85 30.25,3.6 23.35,3.6 20.3,6.65 v19.65,6.65
I2C1_SDA  (via drill 0.51)
  Top 0.305: IC1.5 18.18,6.03 v18.3,5.9 R2.1
  Bottom 0.254: J1.15 31.5,3.7 30.85,3.05 23.1,3.05 20.25,5.9 v18.3,5.9
N$2  (1 unrouted)
N$5  (2 unrouted)
N$6  (2 unrouted)
N$7  (3 unrouted)
N$8  (1 unrouted)
  Top 0.356: 30.52,34.72 31,36.2 X1.1
N$9  (3 unrouted)
N$10  (2 unrouted)
N$11  (2 unrouted)
N$29
  Top 0.406: 80.9,37.6 X6.1
N$34
  Top 0.406: 81.95,25 X7.1
SPI1_MISO  (1 unrouted)
SPI1_MOSI  (1 unrouted)
  Bottom 0.254: J1.20 33.5,10.15 33.05,10.6 32.15,10.6 28.5,14.25
SPI1_NSS  (1 unrouted)
  Bottom 0.254: J1.14 30.5,10.15 27,13.65
SPI1_SCK  (1 unrouted)
  Bottom 0.254: J1.16 31.5,10.2 27.75,13.95
VSUP  (1 unrouted)
WP  (1 unrouted)
  Top 0.305: RWP1.2 RWP0.2 | 16.32,7.33 IC1.7 15.32,7.33 14.35,8.29 14.35,9.9

### Text on the board
tPlace: 2.4-2.4835GHz | Baseband | TX/RX | EEPROM setup | I2C address | 0 | 1 | A2 | A1 | A0 | write | protection
bPlace: Radio Front-End Board Rev A | 7.5-18 MHz wide 2.4-2.5 GHz/Baseband module | for the Marmote platform | http://marmote.googlecode.com | Copyright c 2012 | Vanderbilt University, ISIS